# EAGLE board XMICRO-VDP V1.0 (EAGLE 6.3)
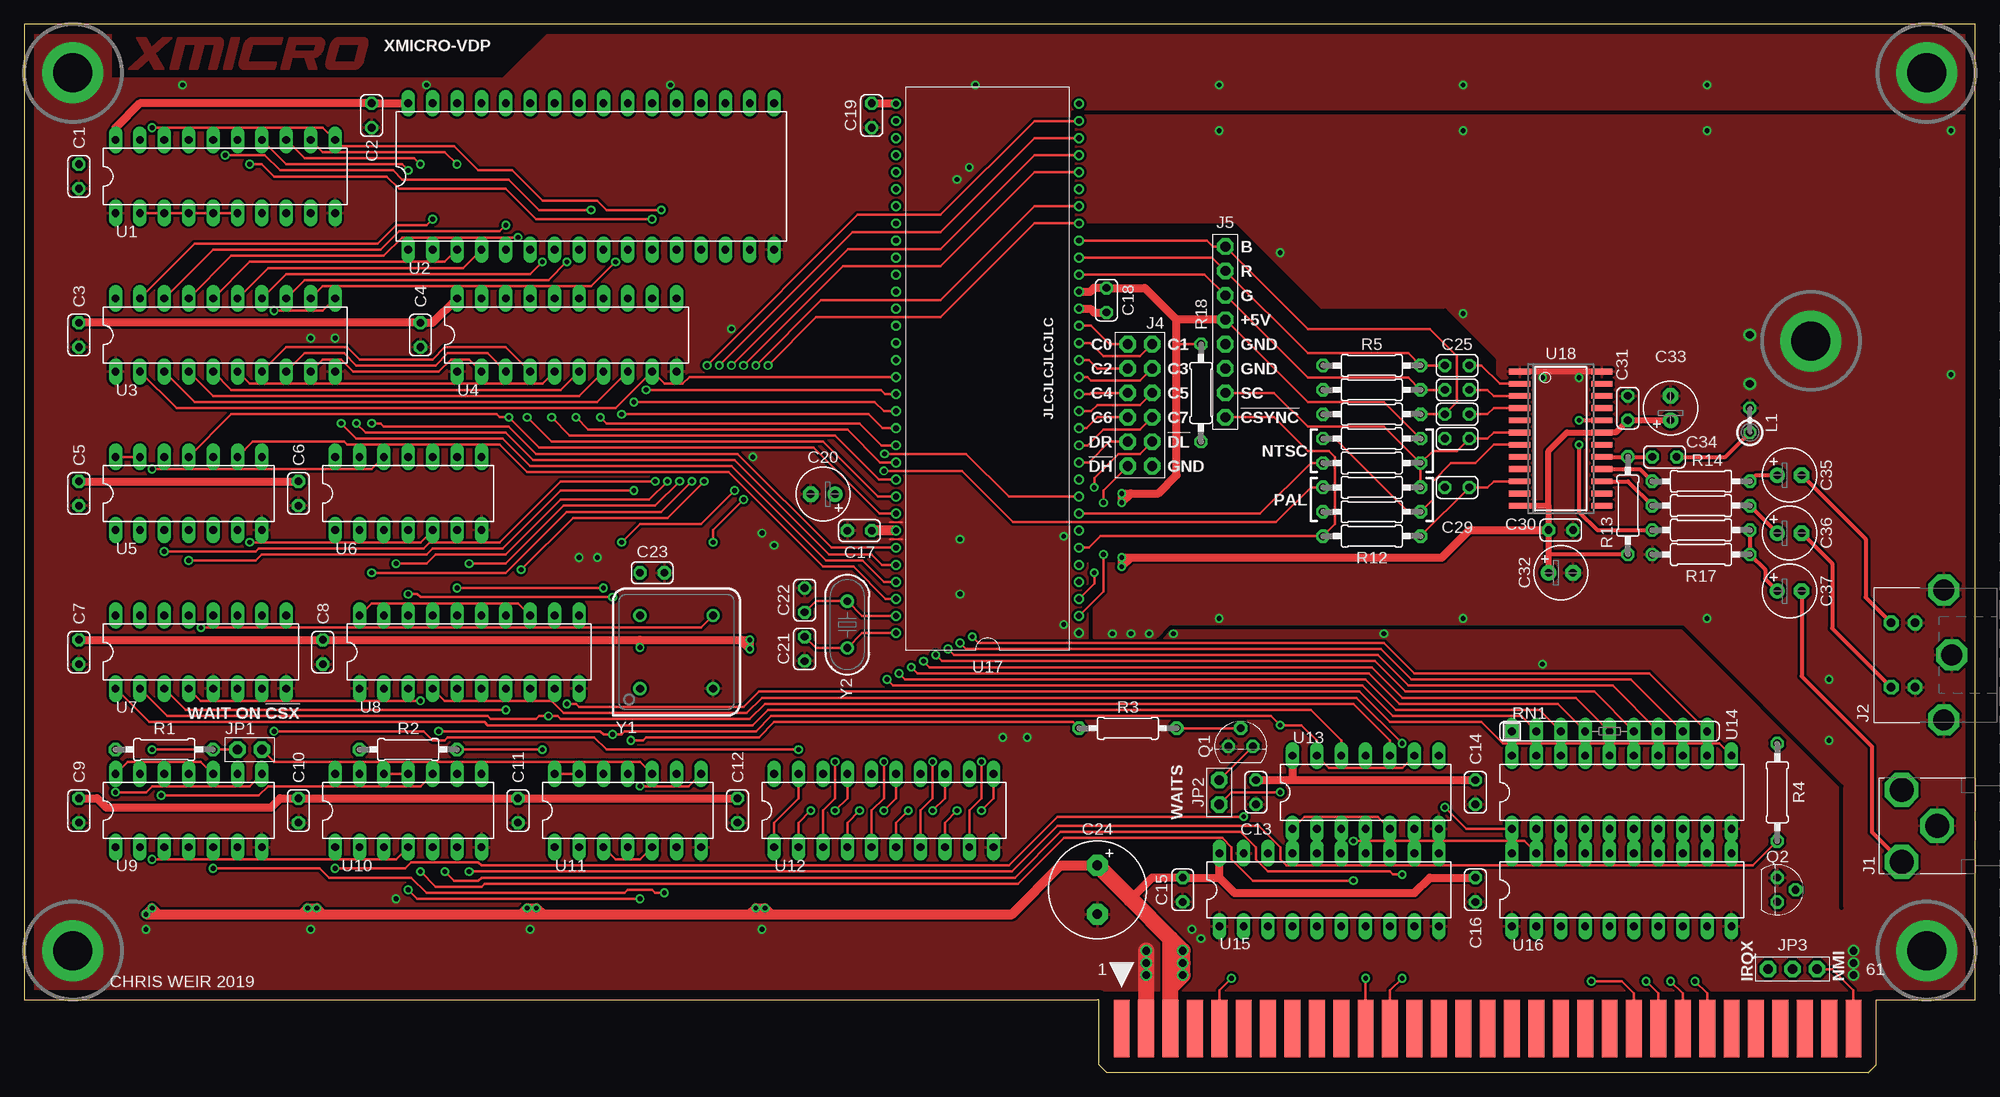
[diagram p5: board, top side]
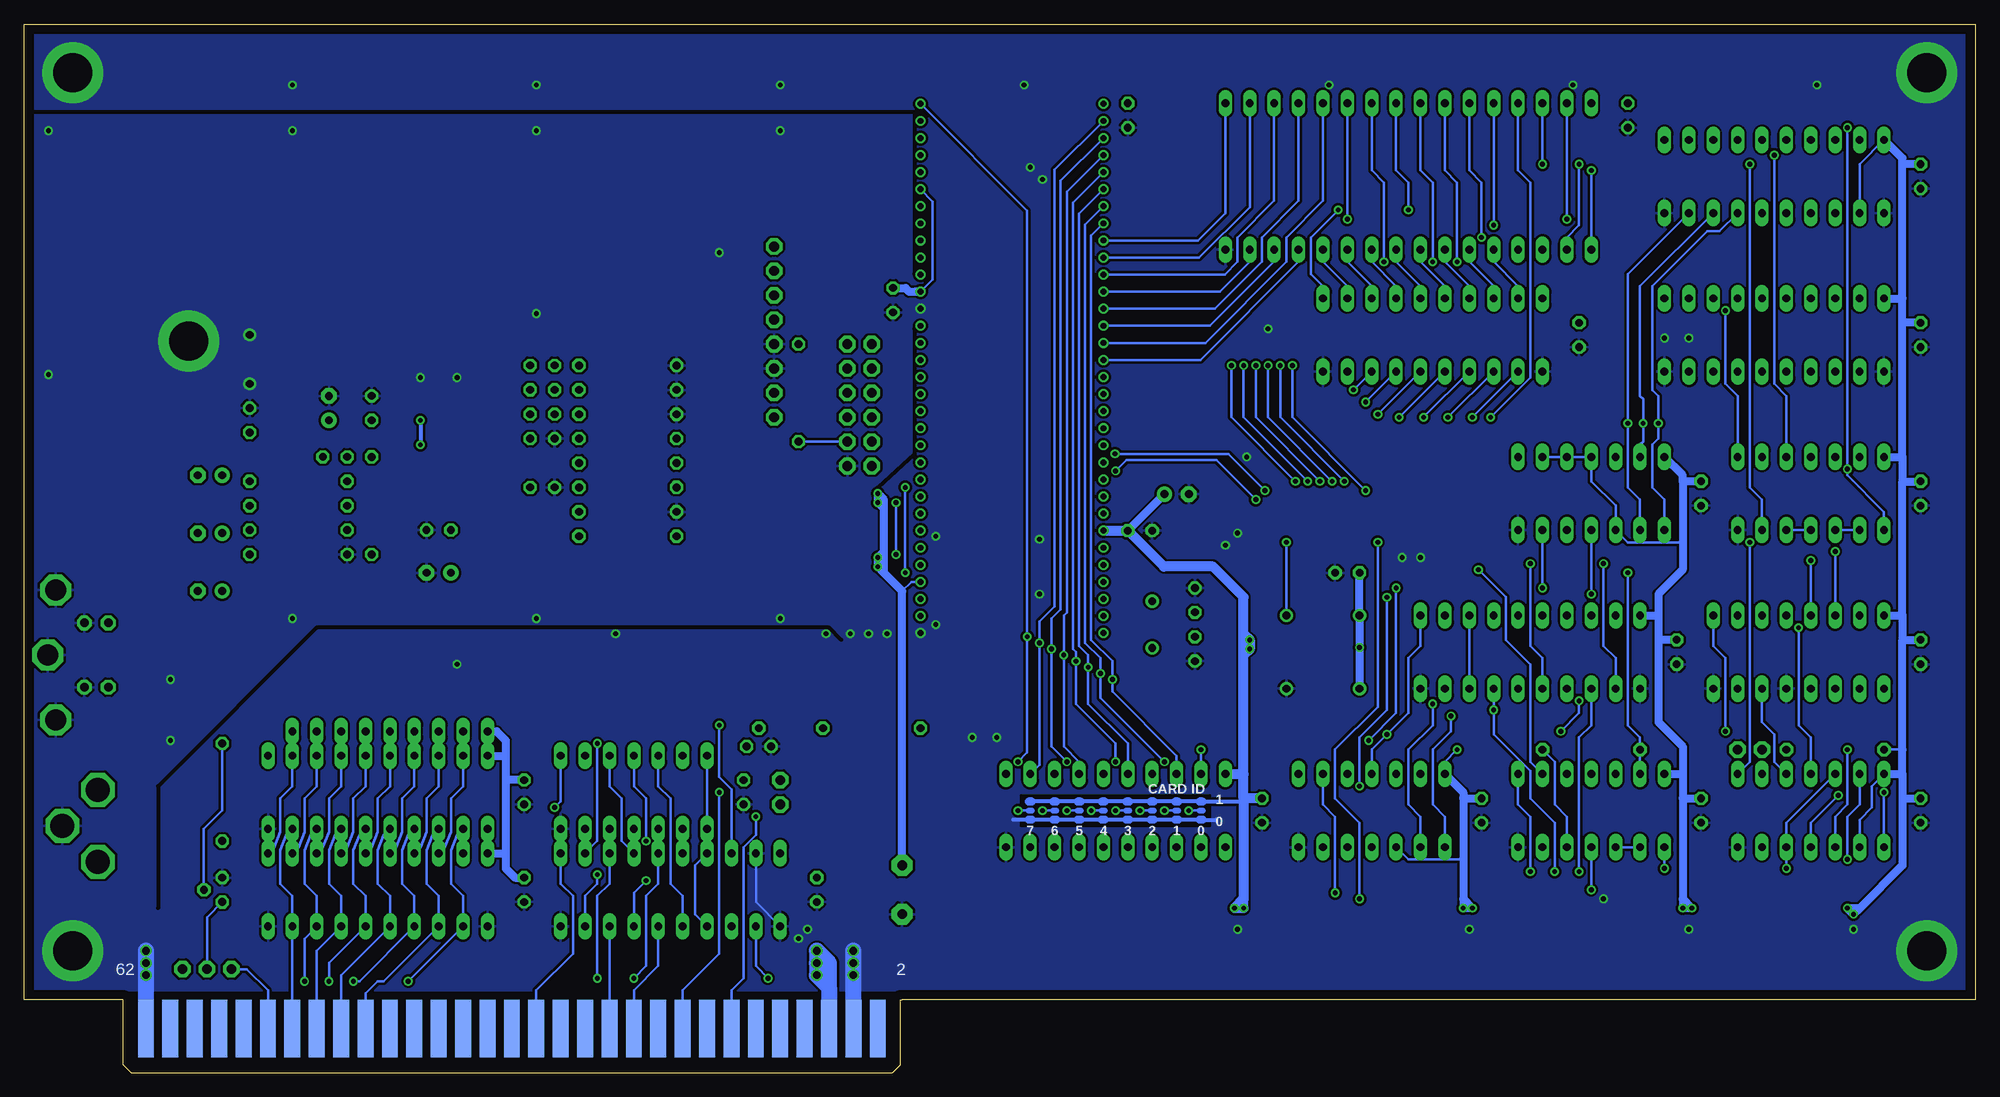
[diagram p6: board, bottom side, seen from below]

Size 203.2 x 109.22 mm. Coordinates in mm from the lower left corner, seen from the top.
Outline: 111.76,7.62 0,7.62 0,109.22 203.2,109.22 203.2,7.62 193.04,7.62
Copper layers (1*16): Top 0.035mm / dielectric 1.5mm / Bottom 0.035mm
Design rules "default *": minimum track width 6mil, minimum drill 0.3mm, track to track 10mil, track to pad 9mil, pad to pad 10mil, via to via 10mil, smd to smd 10mil, copper to edge 40mil, drill to drill 10mil, minimum pad ring 8mil, minimum via ring 8mil, stop-mask expansion 3mil, vias tented up to drill 30mil, thermal gap 10mil
Net classes: 0 default: width 0.254 mm; 1 GND: width 0.254 mm, clearance 0.254 mm to class 0; 2 SUPPLY: width 0.254 mm, clearance 0.254 mm to class 0, clearance 0.381 mm to class 1; 3 LOGO: width 0.152 mm
tRestrict: area 109.2,53.3 to 153,88.3; 7 lines
bRestrict: area 79.7,25.7 to 99.4,28.9; 8 lines

## Footprints (pad centres in the part's own frame; a part is rotated, then mirrored left to right if it is on the bottom)
C100 = drill 0.8 octagon: P$1 -1.27,0; P$2 1.27,0
E2,5-6 = drill 0.813 pad 1.6: + -1.27,0 | drill 0.813 pad 1.6 octagon: - 1.27,0
C-10-5 = drill 1.016 pad 2.184 octagon: + -2.54,0; - 2.54,0
EDGE62M = smd 1.651 x 5.969: 1 -38.1,-3.01; 3 -35.56,-3.01; 5 -33.02,-3.01; 7 -30.48,-3.01; 9 -27.94,-3.01; 11 -25.4,-3.01; 13 -22.86,-3.01; 15 -20.32,-3.01; 17 -17.78,-3.01; 19 -15.24,-3.01; 21 -12.7,-3.01; 23 -10.16,-3.01; 25 -7.62,-3.01; 27 -5.08,-3.01; 29 -2.54,-3.01; 31 0,-3.01; 33 2.54,-3.01; 35 5.08,-3.01; 37 7.62,-3.01; 39 10.16,-3.01; 41 12.7,-3.01; 43 15.24,-3.01; 45 17.78,-3.01; 47 20.32,-3.01; 49 22.86,-3.01; 51 25.4,-3.01; 53 27.94,-3.01; 55 30.48,-3.01; 57 33.02,-3.01; 59 35.56,-3.01; 61 38.1,-3.01 | smd 1.651 x 5.969 bottom: 2 -38.1,-3.01; 4 -35.56,-3.01; 6 -33.02,-3.01; 8 -30.48,-3.01; 10 -27.94,-3.01; 12 -25.4,-3.01; 14 -22.86,-3.01; 16 -20.32,-3.01; 18 -17.78,-3.01; 20 -15.24,-3.01; 22 -12.7,-3.01; 24 -10.16,-3.01; 26 -7.62,-3.01; 28 -5.08,-3.01; 30 -2.54,-3.01; 32 0,-3.01; 34 2.54,-3.01; 36 5.08,-3.01; 38 7.62,-3.01; 40 10.16,-3.01; 42 12.7,-3.01; 44 15.24,-3.01; 46 17.78,-3.01; 48 20.32,-3.01; 50 22.86,-3.01; 52 25.4,-3.01; 54 27.94,-3.01; 56 30.48,-3.01; 58 33.02,-3.01; 60 35.56,-3.01; 62 38.1,-3.01
PJRAN1 = drill 2.5 octagon: SHUNT 3.75,7.7; SLEEVE 0,4; TIP -3.75,7.7
MINI-DIN4 = drill 0.9 octagon: 1 -3.35,-8.51; 2 3.35,-8.51; 3 -3.35,-11; 4 3.35,-11 | drill 2.2 octagon: G$1 6.76,-5.51; G$2 -6.76,-5.51; G$3 0,-4.7
2X06 = drill 1.016 octagon: 1 -6.35,-1.27; 2 -6.35,1.27; 3 -3.81,-1.27; 4 -3.81,1.27; 5 -1.27,-1.27; 6 -1.27,1.27; 7 1.27,-1.27; 8 1.27,1.27; 9 3.81,-1.27; 10 3.81,1.27; 11 6.35,-1.27; 12 6.35,1.27
1X08 = drill 1.016 octagon: 1 -8.89,0; 2 -6.35,0; 3 -3.81,0; 4 -1.27,0; 5 1.27,0; 6 3.81,0; 7 6.35,0; 8 8.89,0
1X02 = drill 1.016 octagon: 1 -1.27,0; 2 1.27,0
1X03 = drill 1.016 octagon: 1 -2.54,0; 2 0,0; 3 2.54,0
0204V = drill 0.813 octagon: 1 -1.27,0; 2 1.27,0
TO92 = drill 0.813 octagon: 1 -1.27,0; 2 0,1.905; 3 1.27,0
0207/10 = drill 0.813 octagon: 1 -5.08,0; 2 5.08,0
SIL9 = drill 0.813 long: 1 -10.16,0; 2 -7.62,0; 3 -5.08,0; 4 -2.54,0; 5 0,0; 6 2.54,0; 7 5.08,0; 8 7.62,0; 9 10.16,0
DIL20 = drill 0.813 long: 1 -11.43,-3.81; 2 -8.89,-3.81; 3 -6.35,-3.81; 4 -3.81,-3.81; 5 -1.27,-3.81; 6 1.27,-3.81; 7 3.81,-3.81; 8 6.35,-3.81; 9 8.89,-3.81; 10 11.43,-3.81; 11 11.43,3.81; 12 8.89,3.81; 13 6.35,3.81; 14 3.81,3.81; 15 1.27,3.81; 16 -1.27,3.81; 17 -3.81,3.81; 18 -6.35,3.81; 19 -8.89,3.81; 20 -11.43,3.81
DIL32-6 = drill 0.813 long: 1 -19.05,-7.62; 2 -16.51,-7.62; 3 -13.97,-7.62; 4 -11.43,-7.62; 5 -8.89,-7.62; 6 -6.35,-7.62; 7 -3.81,-7.62; 8 -1.27,-7.62; 9 1.27,-7.62; 10 3.81,-7.62; 11 6.35,-7.62; 12 8.89,-7.62; 13 11.43,-7.62; 14 13.97,-7.62; 15 16.51,-7.62; 16 19.05,-7.62; 17 19.05,7.62; 18 16.51,7.62; 19 13.97,7.62; 20 11.43,7.62; 21 8.89,7.62; 22 6.35,7.62; 23 3.81,7.62; 24 1.27,7.62; 25 -1.27,7.62; 26 -3.81,7.62; 27 -6.35,7.62; 28 -8.89,7.62; 29 -11.43,7.62; 30 -13.97,7.62; 31 -16.51,7.62; 32 -19.05,7.62
DIL14 = drill 0.813 long: 1 -7.62,-3.81; 2 -5.08,-3.81; 3 -2.54,-3.81; 4 0,-3.81; 5 2.54,-3.81; 6 5.08,-3.81; 7 7.62,-3.81; 8 7.62,3.81; 9 5.08,3.81; 10 2.54,3.81; 11 0,3.81; 12 -2.54,3.81; 13 -5.08,3.81; 14 -7.62,3.81
DIL16 = drill 0.813 long: 1 -8.89,-3.81; 2 -6.35,-3.81; 3 -3.81,-3.81; 4 -1.27,-3.81; 5 1.27,-3.81; 6 3.81,-3.81; 7 6.35,-3.81; 8 8.89,-3.81; 9 8.89,3.81; 10 6.35,3.81; 11 3.81,3.81; 12 1.27,3.81; 13 -1.27,3.81; 14 -3.81,3.81; 15 -6.35,3.81; 16 -8.89,3.81
SDIP64 = drill 0.61 pad 1.016: 1 -27.559,-9.525; 2 -25.781,-9.525; 3 -24.003,-9.525; 4 -22.225,-9.525; 5 -20.447,-9.525; 6 -18.669,-9.525; 7 -16.891,-9.525; 8 -15.113,-9.525; 9 -13.335,-9.525; 10 -11.557,-9.525; 11 -9.779,-9.525; 12 -8.001,-9.525; 13 -6.223,-9.525; 14 -4.445,-9.525; 15 -2.667,-9.525; 16 -0.889,-9.525; 17 0.889,-9.525; 18 2.667,-9.525; 19 4.445,-9.525; 20 6.223,-9.525; 21 8.001,-9.525; 22 9.779,-9.525; 23 11.557,-9.525; 24 13.335,-9.525; 25 15.113,-9.525; 26 16.891,-9.525; 27 18.669,-9.525; 28 20.447,-9.525; 29 22.225,-9.525; 30 24.003,-9.525; 31 25.781,-9.525; 32 27.559,-9.525; 33 27.559,9.525; 34 25.781,9.525; 35 24.003,9.525; 36 22.225,9.525; 37 20.447,9.525; 38 18.669,9.525; 39 16.891,9.525; 40 15.113,9.525; 41 13.335,9.525; 42 11.557,9.525; 43 9.779,9.525; 44 8.001,9.525; 45 6.223,9.525; 46 4.445,9.525; 47 2.667,9.525; 48 0.889,9.525; 49 -0.889,9.525; 50 -2.667,9.525; 51 -4.445,9.525; 52 -6.223,9.525; 53 -8.001,9.525; 54 -9.779,9.525; 55 -11.557,9.525; 56 -13.335,9.525; 57 -15.113,9.525; 58 -16.891,9.525; 59 -18.669,9.525; 60 -20.447,9.525; 61 -22.225,9.525; 62 -24.003,9.525; 63 -25.781,9.525; 64 -27.559,9.525
SOP-24 = smd 0.6 x 2.2: 1 -6.985,-4.282; 2 -5.715,-4.282; 3 -4.445,-4.282; 4 -3.175,-4.282; 5 -1.905,-4.282; 6 -0.635,-4.282; 7 0.635,-4.282; 8 1.905,-4.282; 9 3.175,-4.282; 10 4.445,-4.282; 11 5.715,-4.282; 12 6.985,-4.282; 13 6.985,4.282; 14 5.715,4.282; 15 4.445,4.282; 16 3.175,4.282; 17 1.905,4.282; 18 0.635,4.282; 19 -0.635,4.282; 20 -1.905,4.282; 21 -3.175,4.282; 22 -4.445,4.282; 23 -5.715,4.282; 24 -6.985,4.282
DIL08S = drill 0.813: 1 -3.81,-3.81; 4 3.81,-3.81; 5 3.81,3.81; 8 -3.81,3.81
HC-49US = drill 0.813: 1 -2.44,0; 2 2.44,0

## Placement (x,y rotation side)
C1  0.1uF  [C100]  5.71,93.34 270 top
C2  0.1uF  [C100]  36.2,99.7 270 top
C3  0.1uF  [C100]  5.71,76.84 270 top
C4  0.1uF  [C100]  41.27,76.84 270 top
C5  0.1uF  [C100]  5.71,60.32 270 top
C6  0.1uF  [C100]  28.57,60.32 270 top
C7  0.1uF  [C100]  5.71,43.81 270 top
C8  0.1uF  [C100]  31.11,43.81 270 top
C9  0.1uF  [C100]  5.71,27.3 270 top
C10  0.1uF  [C100]  28.57,27.3 270 top
C11  0.1uF  [C100]  51.44,27.3 270 top
C12  0.1uF  [C100]  74.3,27.3 270 top
C13  0.1uF  [C100]  128.27,29.21 270 top
C14  0.1uF  [C100]  151.13,29.21 270 top
C15  0.1uF  [C100]  120.65,19.05 270 top
C16  0.1uF  [C100]  151.13,19.05 270 top
C17  0.1uF  [C100]  87,56.45 180 top
C18  0.1uF  [C100]  112.71,80.45 270 top
C19  0.1uF  [C100]  88.27,99.7 270 top
C20  47uF  [E2,5-6]  83.19,60.26 180 top
C21  22pF  [C100]  81.28,44.13 270 top
C22  22pF  [C100]  81.28,49.21 90 top
C23  0.1uF  [C100]  65.41,52.07 0 top
C24  220uF  [C-10-5]  111.76,19.05 270 top
C25  0.1uF  [C100]  149.22,73.66 0 top
C26  0.1uF  [C100]  149.22,71.12 0 top
C27  0.1uF  [C100]  149.22,68.58 0 top
C28  5pF  [C100]  149.22,66.04 180 top
C29  47pF  [C100]  149.22,60.96 180 top
C30  10nF  [C100]  160.02,56.52 0 top
C31  10nF  [C100]  167,69.22 90 top
C32  47uF  [E2,5-6]  160.02,52.07 0 top
C33  47uF  [E2,5-6]  171.45,69.22 90 top
C34  28pF  [C100]  170.81,64.14 0 top
C35  220uF  [E2,5-6]  183.83,62.23 0 top
C36  220uF  [E2,5-6]  183.83,56.2 0 top
C37  220uF  [E2,5-6]  183.83,50.16 0 top
CE1  XMICRO-BUS-EDGE62M  [EDGE62M]  152.4,7.62 0 top
J1  PJRAN1XU04AUX  [PJRAN1]  203.2,25.72 90 top
J2  MINI-DIN4  [MINI-DIN4]  205.42,43.5 270 top
J4  PINHD-2X6  [2X06]  116.2,69.53 270 top
J5  PINHD-1X8  [1X08]  125.09,77.15 270 top
JP1  PINHD-1X2THRU  [1X02]  23.5,33.66 180 top
JP2  PINHD-1X2THRU  [1X02]  124.46,29.21 270 top
JP3  PINHD1X3THRU  [1X03]  184.15,10.79 0 top
L1  68uH  [0204V]  179.71,67.95 90 top
Q1  VN2106  [TO92]  126.68,33.97 0 top
Q2  VN2106  [TO92]  182.56,19.05 270 top
R1  10k  [0207/10]  14.61,33.66 180 top
R2  3.3k  [0207/10]  40.01,33.66 0 top
R3  0  [0207/10]  114.94,35.88 0 top
R4  0  [0207/10]  182.56,29.21 90 top
R5  470  [0207/10]  140.34,73.66 0 top
R6  470  [0207/10]  140.34,71.12 0 top
R7  470  [0207/10]  140.34,68.58 0 top
R8  0  [0207/10]  140.34,66.04 0 top
R9  2.2k  [0207/10]  140.34,63.5 0 top
R10  2.2k  [0207/10]  140.34,60.96 0 top
R11  0  [0207/10]  140.34,58.42 180 top
R12  2.2k  [0207/10]  140.34,55.88 0 top
R13  3.32k/1%  [0207/10]  167,59.05 90 top
R14  75  [0207/10]  174.62,61.59 0 top
R15  75  [0207/10]  174.62,59.05 0 top
R16  43  [0207/10]  174.62,56.52 0 top
R17  240  [0207/10]  174.62,53.97 0 top
R18  3.3k  [0207/10]  122.56,70.8 90 top
RN1  10k  [SIL9]  165.1,35.56 0 top
U1  74574  [DIL20]  20.95,93.34 0 top
U2  AS6C4008  [DIL32-6]  59.05,93.34 0 top
U3  74574  [DIL20]  20.95,76.84 0 top
U4  74574  [DIL20]  56.52,76.84 0 top
U5  7404  [DIL14]  17.14,60.32 0 top
U6  7410  [DIL14]  40.01,60.32 0 top
U7  74138  [DIL16]  18.41,43.81 0 top
U8  74373  [DIL20]  46.35,43.81 0 top
U9  7474  [DIL14]  17.14,27.3 0 top
U10  7414  [DIL14]  40.01,27.3 0 top
U11  7404  [DIL14]  62.87,27.3 0 top
U12  74244  [DIL20]  89.53,27.3 0 top
U13  7432  [DIL14]  139.7,29.21 0 top
U14  74574  [DIL20]  166.37,29.21 0 top
U15  74244  [DIL20]  135.89,19.05 0 top
U16  74245  [DIL20]  166.37,19.05 0 top
U17  V9958  [SDIP64]  100.33,73.34 90 top
U18  CXA2075  [SOP-24]  160.02,66.04 270 top
Y1  5MHz  [DIL08S]  67.94,43.81 0 top
Y2  21.47727MHz  [HC-49US]  85.72,46.67 90 top

## Tracks (layer width: path | path; a pad name or v marks a point on that pad's centre or on a via)
!BCSX  (via drill 0.5)
  Top 0.254: CE1.9 124.46,8.57 v125.73,9.84
  Bottom 0.254: v125.73,9.84 127,11.11 U15.2
!BRD  (via drill 0.5)
  Top 0.254: CE1.21 v139.7,9.84
  Bottom 0.254: v139.7,9.84 138.43,11.11 138.43,18.41 137.16,19.68 U15.15
!BRST  (via drill 0.5)
  Top 0.254: v127,26.67 107.63,26.67 102.55,21.59 47.62,21.59 47.31,21.91 40.32,21.91 39.69,21.27 v32.38,21.27
  Bottom 0.254: CE1.14 129.54,8.57 128.27,9.84 128.27,23.5 127,24.77 v127,26.67 | v32.38,21.27 U10.1
!BWAIT  (via drill 0.5)
  Top 0.254: v130.81,29.21 125.73,29.21 JP2.2
  Bottom 0.254: CE1.18 134.62,8.57 130.81,12.38 v130.81,29.21
!BWR
  Bottom 0.254: CE1.22 139.7,8.57 137.16,11.11 U15.6
!CSIDR  (via drill 0.5)
  Top 0.254: U12.1 78.11,26.04 80.64,28.57 U12.19 | v26.04,35.56 41.59,35.56 42.55,34.61 43.81,34.61 44.13,34.92 59.37,34.92 60.64,33.66 v80.64,33.66
  Bottom 0.254: U7.9 27.3,44.45 26.04,43.18 v26.04,35.56 | v80.64,33.66 U12.19
!CSVR  (via drill 0.5)
  Top 0.254: v63.5,60.64 55.88,60.64 49.85,54.61 42.55,54.61 41.91,53.97 24.77,53.97 24.13,53.34 v17.14,53.34 | v71.12,73.66 86.81,89.34 95.44,89.34 105.22,99.12 U17.31
  Bottom 0.254: v63.5,60.64 71.12,68.26 v71.12,73.66 | v17.14,53.34 U7.13
!CSVW  (via drill 0.5)
  Top 0.254: v72.39,73.66 86.3,87.57 95.44,87.57 105.22,97.34 U17.30 | v65.72,61.59 55.88,61.59 49.53,55.24 42.23,55.24 41.59,54.61 24.45,54.61 24.13,54.29 v14.61,54.29
  Bottom 0.254: v72.39,73.66 72.39,68.26 v65.72,61.59 | v14.61,54.29 U7.14
!CSX  (via drill 0.5)
  Top 0.254: U13.9 143.51,31.75 135.89,31.75 U13.13 134.62,34.61 133.03,36.2 v130.81,36.2 129.86,37.15 77.79,37.15 76.2,35.56 62.55,35.56 62.23,35.24 v61.28,35.24 60.33,35.24 60.01,35.56 v43.18,35.56 | U7.4 18.41,38.73 v41.27,38.73
  Bottom 0.254: U15.18 129.54,29.53 130.81,30.8 v130.81,36.2 | U11.11 62.87,33.66 v61.28,35.24 59.05,37.46 59.05,43.18 57.78,44.45 U8.11 | v41.27,38.73 41.27,37.46 v43.18,35.56
!CSYNC
  Top 0.254: U17.6 110.87,54.67 112.08,55.88 R12.1 136.53,57.15 136.53,64.14 135.89,64.77 133.67,64.77 130.18,68.26 J5.8
!DHCLK  (via drill 0.5)
  Top 0.254: U17.2 112.39,50.1 v112.39,53.97 | v112.39,59.37 112.39,60.64 J4.11
  Bottom 0.254: v112.39,53.97 v112.39,59.37
!DLCLK  (via drill 0.5)
  Top 0.254: U17.3 111.44,50.93 v111.44,52.07 | v111.44,60.96 111.44,61.91 113.98,64.45 116.2,64.45 J4.10
  Bottom 0.254: v111.44,52.07 v111.44,60.96 | J4.10 R18.1
!RD
  Top 0.254: U13.12 137.16,34.61 133.99,37.78 77.47,37.78 75.88,36.2 48.26,36.2 47.94,36.51 13.02,36.51 U7.1
  Bottom 0.254: U15.5 134.62,18.41 135.89,19.68 135.89,28.57 137.16,29.85 U13.12
!RST  (via drill 0.5)
  Top 0.254: U17.9 102.55,60.01 98.11,64.45 v89.6,64.45 | v73.98,60.64 70.48,57.15 64.14,57.15 v62.23,55.24 | v13.34,22.23 38.73,22.23 U10.4 | v64.14,18.1 40.96,18.1 v40.01,19.05
  Bottom 0.254: v89.6,64.45 77.79,64.45 v73.98,60.64 | U9.13 12.06,27.94 13.34,26.67 v13.34,22.23 | v62.23,55.24 62.23,38.1 66.67,33.66 66.67,28.57 64.14,26.04 v64.14,18.1 | v40.01,19.05 U10.4
!VCAS0  (via drill 0.5)
  Top 0.254: v33.02,67.63 34.61,66.04 49.85,66.04 52.7,63.18 73.66,63.18 83.5,53.34 87.31,53.34 89.53,51.12 U17.61
  Bottom 0.254: U1.7 26.67,87.63 27.94,87.63 33.66,81.92 33.66,71.12 33.02,70.48 v33.02,67.63 33.02,66.04 33.66,65.41 33.66,60.96 32.38,59.69 U6.1
!VCAS1  (via drill 0.5)
  Top 0.254: U17.60 89.34,52.9 88.27,53.97 83.82,53.97 73.98,63.82 53.02,63.82 50.16,66.67 35.56,66.67 v34.61,67.63
  Bottom 0.254: U1.8 34.92,81.92 34.92,70.48 34.61,70.17 v34.61,67.63 34.61,65.72 34.92,65.41 U6.13
!VCAS2  (via drill 0.5)
  Top 0.254: v36.2,67.63 37.15,67.63 37.47,67.31 50.48,67.31 53.34,64.45 74.3,64.45 84.07,54.67 U17.59
  Bottom 0.254: U1.9 36.2,83.19 v36.2,67.63 36.2,60.96 34.92,59.69 U6.2
!VINT  (via drill 0.5)
  Top 0.254: U17.25 105.22,88.45 95.44,78.68 82.49,78.68 v77.47,73.66 | v70.8,61.59 66.99,57.78 57.15,57.78 v51.75,52.39
  Bottom 0.254: v77.47,73.66 77.47,68.26 v70.8,61.59 | v51.75,52.39 48.9,49.53 48.9,45.09 46.35,42.54 46.35,32.38 U10.9
!VRAS
  Top 0.254: U5.9 23.81,65.72 33.34,65.72 33.66,65.41 49.53,65.41 52.39,62.55 73.34,62.55 83.19,52.7 86.36,52.7 89.72,49.34 U17.62
!VWAIT  (via drill 0.5)
  Top 0.254: U17.26 105.22,90.23 95.44,80.45 83,80.45 v76.2,73.66 | v69.53,61.59 66.36,58.42 56.52,58.42 50.16,52.07 v36.2,52.07
  Bottom 0.254: U10.13 R2.1 34.92,34.92 36.2,36.2 v36.2,52.07 | v76.2,73.66 76.2,68.26 v69.53,61.59
!WR  (via drill 0.5)
  Top 0.254: U13.10 142.24,34.61 138.43,38.42 77.15,38.42 75.56,36.83 55.88,36.83 55.56,37.15 v54.61,37.15 53.66,37.15 53.34,36.83 48.58,36.83 48.26,37.15 14.92,37.15 U7.2
  Bottom 0.254: U15.14 140.97,24.13 140.97,28.57 142.24,29.85 U13.10 | U11.1 55.24,26.67 56.52,27.94 56.52,33.66 54.61,35.56 v54.61,37.15
A0  (via drill 0.5)
  Top 0.254: v138.43,20 127.95,20 125.73,22.23 125.73,23.5 124.78,24.45 108.27,24.45 103.5,19.68 47.94,19.68 47.62,19.37 42.86,19.37 v41.27,20.96
  Bottom 0.254: U15.7 139.7,18.73 v138.43,20 | v41.27,20.96 41.27,34.92 40.01,36.2 U8.3
A1  (via drill 0.5)
  Top 0.254: v143.51,34.29 138.75,39.05 76.83,39.05 75.25,37.46 56.2,37.46 54.93,38.73 43.81,38.73 U8.4
  Bottom 0.254: U15.12 143.51,24.13 v143.51,34.29
A7  (via drill 0.5)
  Top 0.254: v143.51,20.64 142.56,20.64 142.24,20.96 129.54,20.96 128.27,22.23 128.27,23.5 126.68,25.08 107.95,25.08 103.19,20.32 47.62,20.32 47.31,20 44.77,20 v43.81,20.96 | U7.3 16.83,37.78 v50.16,37.78
  Bottom 0.254: U15.9 144.78,18.41 143.51,19.68 v143.51,20.64 | v43.81,20.96 43.81,26.04 46.35,28.57 46.35,31.43 50.16,35.24 v50.16,37.78 U8.7
B
  Top 0.254: R7.2 C27.P$1 149.22,69.85 149.22,74.61 146.37,77.47 133.67,77.47 J5.1 123.83,86.04 123.19,86.68 U17.24
BA0  (via drill 0.5)
  Top 0.254: CE1.23 142.24,8.57 v143.51,9.84
  Bottom 0.254: v143.51,9.84 143.51,18.41 142.24,19.68 U15.13
BA1
  Bottom 0.254: CE1.24 U15.8
BA7
  Bottom 0.254: CE1.30 149.86,8.57 146.05,12.38 146.05,18.41 147.32,19.68 U15.11
C0
  Top 0.254: U17.19 111.12,77.79 113.03,75.88 J4.1
C1
  Top 0.254: U17.18 111,76.01 112.39,74.61 116.2,74.61 J4.2
C2
  Top 0.254: U17.17 110.87,74.23 111.76,73.34 J4.3
C3
  Top 0.254: U17.16 110.74,72.45 111.12,72.07 116.2,72.07 J4.4
C4
  Top 0.254: U17.15 111,70.68 111.12,70.8 J4.5
C5
  Top 0.254: U17.14 111.12,68.9 111.76,69.53 116.2,69.53 J4.6
C6
  Top 0.254: U17.13 110.62,67.12 111.76,68.26 J4.7
C7
  Top 0.254: U17.12 110.74,65.34 112.39,66.99 116.2,66.99 J4.8
CBDR
  Top 0.254: U17.11 110.87,63.56 113.03,65.72 J4.9
D0  (via drill 0.5)
  Top 0.254: RN1.2 155.89,37.15 142.56,37.15 139.38,40.32 90.49,40.32 v89.85,40.96
  Bottom 0.254: U16.18 159.38,23.5 158.75,25.08 158.75,28.57 157.48,29.85 U14.19 RN1.2 | U17.40 92.08,87.19 92.08,45.09 89.85,42.86 v89.85,40.96 89.85,39.69 83.19,33.02 U12.18
D1  (via drill 0.5)
  Top 0.254: RN1.3 157.8,37.78 142.88,37.78 139.7,40.96 91.76,40.96 v91.12,41.59 | U12.3 83.19,27.3 84.45,28.57 v84.45,32.38
  Bottom 0.254: U16.17 161.93,23.5 161.29,25.08 161.29,28.57 160.02,29.85 U14.18 RN1.3 | U17.39 92.71,88.33 92.71,44.77 91.12,43.18 v91.12,41.59 91.12,39.05 v84.45,32.38
D2  (via drill 0.5)
  Top 0.254: RN1.4 159.7,38.42 143.19,38.42 140.02,41.59 93.03,41.59 v92.39,42.23
  Bottom 0.254: U16.16 164.47,23.5 163.83,25.08 163.83,28.57 162.56,29.85 U14.17 RN1.4 | U17.38 93.34,89.47 93.34,44.45 92.39,43.5 v92.39,42.23 92.39,38.42 88.27,34.29 U12.16
D3  (via drill 0.5)
  Top 0.254: RN1.5 161.61,39.05 143.51,39.05 140.34,42.23 94.3,42.23 v93.66,42.86 | U12.5 88.27,27.3 89.53,28.57 v89.53,32.38
  Bottom 0.254: U16.15 167,23.5 166.37,25.08 166.37,28.57 165.1,29.85 U14.16 RN1.5 | U17.37 93.98,90.62 93.98,44.13 93.66,43.81 v93.66,42.86 93.66,38.42 89.53,34.29 v89.53,32.38
D4  (via drill 0.5)
  Top 0.254: RN1.6 163.51,39.69 143.83,39.69 140.65,42.86 95.57,42.86 v94.93,43.5
  Bottom 0.254: U16.14 169.54,23.5 168.91,25.08 168.91,28.57 167.64,29.85 U14.15 RN1.6 | U17.36 94.61,91.76 94.61,47.94 94.93,47.62 v94.93,43.5 94.93,33.97 93.34,32.38 U12.14
D5  (via drill 0.5)
  Top 0.254: RN1.7 165.42,40.32 144.15,40.32 140.97,43.5 96.84,43.5 v96.2,44.13 | U12.7 93.34,27.3 94.61,28.57 v94.61,32.38
  Bottom 0.254: U16.13 172.09,23.5 171.45,25.08 171.45,28.57 170.18,29.85 U14.14 RN1.7 | U17.35 95.25,92.9 95.25,48.26 96.2,47.31 v96.2,44.13 96.2,33.97 v94.61,32.38
D6  (via drill 0.5)
  Top 0.254: RN1.8 167.32,40.96 144.46,40.96 141.29,44.13 98.11,44.13 v97.47,44.77
  Bottom 0.254: U16.12 174.62,23.5 173.99,25.08 173.99,28.57 172.72,29.85 U14.13 RN1.8 | U17.34 95.89,94.04 95.89,48.58 97.47,46.99 v97.47,44.77 97.47,32.07 U12.12
D7  (via drill 0.5)
  Top 0.254: RN1.9 169.23,41.59 144.78,41.59 141.6,44.77 99.38,44.77 v98.74,45.4 | U12.9 98.42,27.3 99.69,28.57 v99.69,32.38
  Bottom 0.254: U16.11 177.16,23.5 176.53,25.08 176.53,28.57 175.26,29.85 U14.12 RN1.9 | U17.32 98.74,89.79 v98.74,45.4 98.74,33.34 v99.69,32.38
G
  Top 0.254: C26.P$1 R6.2 144.15,72.39 133.67,72.39 J5.3 122.94,83.12 U17.22
GND  (via drill 0.5, 0.8, 0.8 pad 1.32, 4.06 pad 6.35)
  Top 0.229: 90.17,55.56 91.44,55.56 | 90.17,57.34 91.44,57.34
  Top 0.61: U18.24 U18.1
  Top 0.813: U17.20 111.03,79.56 111.41,79.18 C18.P$2
  Top 1.651: v116.84,12.7 v116.84,11.43 v116.84,10.16 CE1.4
  Bottom 0.254: U15.19 127,17.78 U15.1
  Bottom 0.406: 98.58,26.35 100.17,26.35 | 96.04,26.35 98.27,26.35 | 93.5,26.35 95.73,26.35 | 90.96,26.35 93.19,26.35 | 88.42,26.35 90.65,26.35 | 85.88,26.35 88.11,26.35 | 83.34,26.35 85.57,26.35 | 80.8,26.35 83.03,26.35 | 80.49,26.35 79.06,26.35
  Bottom 0.813: 98.27,26.35 98.58,26.35 | 95.73,26.35 96.04,26.35 | 93.19,26.35 93.5,26.35 | 90.65,26.35 90.96,26.35 | 88.11,26.35 88.42,26.35 | 85.57,26.35 85.88,26.35 | 83.03,26.35 83.34,26.35 | 80.49,26.35 80.8,26.35
  Bottom 1.651: CE1.4 v116.84,10.16 v116.84,11.43 v116.84,12.7 | CE1.62 v190.5,10.16 v190.5,11.43 v190.5,12.7
  other vias: 5.08,12.7 5.08,104.14 158.12,72.39 161.93,72.39 198.12,12.7 198.12,104.14 32.38,76.52 179.71,71.76 179.71,76.84 121.6,14.92 122.56,13.97 57.78,53.66 59.69,53.66 78.11,54.93 75.88,64.14 76.83,56.2 119.7,45.72 141.6,45.72 158.12,42.54 108.27,46.67 104.46,34.92 101.92,34.92 97.47,49.85 97.47,55.56 38.73,18.1 52.7,14.92 76.83,14.92 29.84,14.92 12.7,14.92 29.84,76.52 97.16,93.03 98.42,94.3 113.35,45.72 117.16,45.72 115.25,45.72 186.06,76.2 108.27,55.88 200.66,98.11 175.26,98.11 149.86,98.11 124.46,98.11 149.86,79.06 130.81,85.41 200.66,72.71 124.46,47.31 149.86,47.31 175.26,47.31 187.96,34.61 187.96,40.96 175.26,102.87 149.86,102.87 124.46,102.87 99.06,102.87 67.31,102.87 41.91,102.87 16.51,102.87 73.66,77.47
  pour Bottom (rank 3): 0,109.22 203.2,109.22 203.2,7.62 192.72,7.62 192.72,8.57 112.08,8.57 112.08,7.62 0,7.62
  pour Top (rank 3): 0,109.22 9.02,109.22 9.02,103.51 49.85,103.51 55.56,109.22 203.2,109.22 203.2,7.62 192.72,7.62 192.72,8.57 112.08,8.57 112.08,7.62 0,7.62
  pour Top (isolate 0.254): 92.08,58.04 92.08,54.86 89.53,54.86 89.53,58.04
  pour Top (isolate 0.254, no thermals): 110.81,46.74 110.81,44.64 108.9,44.64 108.9,46.74
  pour Bottom (isolate 0.254, no thermals): 110.81,46.74 110.81,44.64 108.9,44.64 108.9,46.74
  pour Bottom (isolate 0.254, no thermals): 110.81,80.39 110.81,78.61 108.9,78.61 108.9,80.39
ID0  (via drill 0.5)
  Top 0.254: U12.2 80.64,26.04 v81.92,27.3
  Bottom 0.254: v81.92,27.3 80.8,27.3
  Bottom 0.61: 80.8,27.3 80.49,27.3
ID1  (via drill 0.5)
  Top 0.254: U12.17 85.72,28.57 v84.45,27.3
  Bottom 0.254: v84.45,27.3 83.34,27.3
  Bottom 0.61: 83.34,27.3 83.03,27.3
ID2  (via drill 0.5)
  Top 0.254: U12.4 85.72,26.04 v87,27.3
  Bottom 0.254: v87,27.3 85.88,27.3
  Bottom 0.61: 85.88,27.3 85.57,27.3
ID3  (via drill 0.5)
  Top 0.254: U12.15 90.81,28.57 v89.53,27.3
  Bottom 0.254: v89.53,27.3 88.42,27.3
  Bottom 0.61: 88.42,27.3 88.11,27.3
ID4  (via drill 0.5)
  Top 0.254: U12.6 90.81,26.04 v92.08,27.3
  Bottom 0.254: v92.08,27.3 90.96,27.3
  Bottom 0.61: 90.96,27.3 90.65,27.3
ID5  (via drill 0.5)
  Top 0.254: U12.13 95.89,28.57 v94.61,27.3
  Bottom 0.254: v94.61,27.3 93.5,27.3
  Bottom 0.61: 93.5,27.3 93.19,27.3
ID6  (via drill 0.5)
  Top 0.254: U12.8 95.89,26.04 v97.16,27.3
  Bottom 0.254: v97.16,27.3 96.04,27.3
  Bottom 0.61: 96.04,27.3 95.73,27.3
ID7  (via drill 0.5)
  Top 0.254: U12.11 100.97,28.57 v99.69,27.3
  Bottom 0.254: v99.69,27.3 98.58,27.3
  Bottom 0.61: 98.58,27.3 98.27,27.3
LOGO
  pour Top: 26.95,107.79 26.78,107.1 23.79,107.1 23.31,105.22 26.28,105.22 26.12,104.53 22.83,104.53 arc-47 22.56,104.64 arc-36 22.42,104.96 arc-17 22.43,105.22 arc-5 22.46,105.37 22.86,106.95 arc-33 23.23,107.55 arc-31 23.61,107.78 arc-13 23.75,107.79
  pour Top: 10.87,104.53 11.86,104.53 12.97,105.56 13.53,104.53 14.58,104.53 13.63,106.16 15.41,107.79 14.43,107.79 13.3,106.75 12.74,107.79 11.7,107.79 12.64,106.13
  pour Top: 21.56,107.79 22.44,107.79 21.6,104.53 20.72,104.53
  pour Top: 27.6,107.79 28.3,107.1 28.12,106.39 30.23,106.39 30.41,107.1 28.32,107.1 27.62,107.79 30.75,107.79 arc-55 31.17,107.58 arc-31 31.28,107.32 arc-18 31.25,107 31.14,106.58 arc-18 31.06,106.4 arc-18 30.75,106 arc-19 30.44,105.8 arc-14 30.09,105.74 30.52,104.53 29.65,104.53 29.21,105.75 27.94,105.75 27.62,104.53 26.75,104.53
  pour Top: 15.17,104.53 16.01,107.79 20.29,107.79 arc-50 20.62,107.66 arc-37 20.75,107.37 arc-17 20.72,106.99 20.08,104.53 19.21,104.53 19.88,107.1 18.74,107.1 18.07,104.53 17.19,104.53 17.86,107.1 16.72,107.1 16.05,104.53
  pour Top: 32.83,107.1 34.92,107.1 34.42,105.22 32.3,105.22 32.8,107.1 32.85,107.79 32.75,107.79 arc33 32.36,107.65 arc19 32.07,107.33 arc18 31.89,106.95 31.47,105.35 arc9 31.45,105.25 arc9 31.44,105.01 arc22 31.48,104.8 arc36 31.61,104.62 arc17 31.73,104.55 arc13 31.87,104.53 34.45,104.53 arc18 34.66,104.55 arc16 34.84,104.65 arc14 35.08,104.87 arc26 35.33,105.34 35.77,107.01 arc17 35.79,107.29 arc19 35.75,107.51 arc66 35.37,107.79 32.88,107.79
N$3
  Top 0.254: U18.2 153.67,71.76 151.76,73.66 C25.P$2
N$4
  Top 0.254: U18.3 153.03,70.48 152.4,71.12 C26.P$2
N$5
  Top 0.254: U18.4 153.03,69.22 152.4,68.58 C27.P$2
N$9
  Bottom 0.254: R4.2 182.56,27.3 184.47,25.4 Q2.2
N$10
  Bottom 0.254: Q2.3 184.15,16.19 JP3.2
N$11  (via drill 0.5)
  Top 0.254: v46.35,20.96 102.87,20.96 107.63,25.72 128.59,25.72 130.81,23.5 130.81,22.23 131.44,21.59 180.02,21.59 R4.1
  Bottom 0.254: v46.35,20.96 46.35,26.67 47.62,27.94 U10.8
N$12
  Top 0.406: U18.15 167,61.59 R15.1
N$13
  Top 0.406: U18.16 168.28,62.86 R14.1
N$14  (via drill 0.5)
  Top 0.406: U18.20 v161.93,67.95 | v161.93,65.41 161.93,58.42 163.83,56.52 R16.1
  Bottom 0.406: v161.93,67.95 v161.93,65.41
N$15
  Top 0.406: R16.2 R17.2 181.29,52.39 181.29,51.43 C37.+
N$16
  Top 0.406: R14.2 180.34,62.23 C35.+
N$17
  Top 0.406: R15.2 C36.+
N$18
  Top 0.254: JP2.1 Q1.3
N$19  (via drill 0.5)
  Top 0.254: U10.10 41.27,29.85 25.4,29.85 24.45,28.89 v14.29,28.89
  Bottom 0.254: v14.29,28.89 17.14,26.04 U9.4
N$20
  Top 0.254: U10.12 U10.11
N$21
  Top 0.406: C34.P$2 177.16,64.14 L1.1
N$22
  Top 0.254: U18.10 153.03,61.59 152.4,60.96 C29.P$1 R12.2
N$26
  Top 0.254: U18.7 153.03,65.41 151.13,63.5 148.59,63.5 146.69,61.59 146.69,59.69 R11.1 144.15,58.42 136.53,66.04 R8.1
N$27
  Bottom 0.254: U10.3 U10.2
N$28
  Top 0.254: U17.63 87.28,47.56 Y2.2 82.45,49.11 C22.P$1
N$29
  Top 0.406: C36.- 188.28,53.02 188.28,46.29 J2.4
N$30
  Top 0.254: U17.64 87.28,45.78 Y2.1 82.45,44.23 C21.P$1
N$31  (via drill 0.5)
  Top 0.254: v26.04,79.38 31.11,79.38 U3.11
  Bottom 0.254: U5.8 24.77,70.48 26.04,71.76 v26.04,79.38
N$32
  Bottom 0.254: U4.12 65.41,81.92 67.94,84.45 U2.12
N$33
  Bottom 0.254: U14.9 175.9,24.77 176.53,23.18 176.53,19.68 175.26,18.41 U16.9 CE1.50
N$34  (via drill 0.5)
  Top 0.254: v173.99,9.53 175.26,8.26 CE1.49
  Bottom 0.254: U14.8 173.35,24.77 173.99,23.18 173.99,19.68 172.72,18.41 U16.8 173.99,13.97 v173.99,9.53
N$35
  Bottom 0.254: U14.7 170.81,24.77 171.45,23.18 171.45,19.68 170.18,18.41 U16.7 172.72,12.7 CE1.48
N$36  (via drill 0.5)
  Top 0.254: CE1.47 172.72,8.26 v171.45,9.53
  Bottom 0.254: U14.6 168.28,24.77 168.91,23.18 168.91,19.68 167.64,18.41 U16.6 171.45,11.43 v171.45,9.53
N$37
  Bottom 0.254: U14.5 165.74,24.77 166.37,23.18 166.37,19.68 165.1,18.41 U16.5 170.18,10.16 CE1.46
N$38  (via drill 0.5)
  Top 0.254: CE1.45 170.18,8.26 v168.91,9.53
  Bottom 0.254: U14.4 163.19,24.77 163.83,23.18 163.83,19.68 162.56,18.41 U16.4 168.28,9.53 v168.91,9.53
N$39
  Bottom 0.254: U14.3 160.66,24.77 161.29,23.18 161.29,19.68 160.02,18.41 U16.3 165.74,9.53 166.37,9.53 167.64,8.26 CE1.44
N$40  (via drill 0.5)
  Top 0.254: CE1.43 167.64,8.26 166.37,9.53 v163.19,9.53
  Bottom 0.254: U14.2 158.12,24.77 158.75,23.18 158.75,19.68 157.48,18.41 U16.2 v163.19,9.53
N$41
  Bottom 0.254: U4.13 62.87,81.92 65.41,84.45 U2.11
N$42
  Bottom 0.254: U2.10 62.87,84.45 60.33,81.92 U4.14
N$43
  Bottom 0.254: U2.9 60.33,84.45 57.78,81.92 U4.15
N$44
  Bottom 0.254: U2.8 57.78,84.45 55.24,81.92 U4.16
N$45
  Bottom 0.254: U2.7 55.24,84.45 52.7,81.92 U4.17
N$46
  Bottom 0.254: U2.6 52.7,84.45 50.16,81.92 U4.18
N$47
  Bottom 0.254: U2.5 50.16,84.45 47.62,81.92 U4.19
N$48  (via drill 0.5)
  Top 0.254: v66.36,89.85 60.64,89.85 59.69,90.81 53.98,90.81 50.8,93.98 47.31,93.98 44.77,96.52 33.02,96.52 U1.11 31.11,98.43 v13.34,98.43 | U6.12 36.2,62.86 v13.34,62.86
  Bottom 0.254: v66.36,89.85 69.22,87 69.22,83.19 67.94,81.92 U4.11 | U5.1 9.53,58.42 13.34,62.23 v13.34,62.86 v13.34,98.43
N$49  (via drill 0.5)
  Top 0.254: v20.95,95.57 25.08,95.57 26.67,93.98 38.42,93.98 39.37,93.03 50.48,93.03 53.66,89.85 v59.05,89.85
  Bottom 0.254: U5.10 19.68,70.48 20.95,71.76 v20.95,95.57 | v59.05,89.85 59.05,92.71 60.33,93.98 U2.24
N$50  (via drill 0.5)
  Top 0.254: v23.5,94.62 24.77,94.62 26.04,93.34 37.78,93.34 39.05,92.08 50.16,92.08 53.34,88.9 v65.41,88.9
  Bottom 0.254: U5.6 22.23,59.69 23.5,60.96 v23.5,94.62 | v65.41,88.9 U2.22
N$51
  Top 0.254: R3.2 Q1.2
N$52
  Top 0.254: U11.10 64.14,32.38 26.04,32.38 JP1.1
N$53
  Top 0.406: C37.- 185.1,41.27 192.41,33.97 192.41,25.06 J1.TIP
N$54  (via drill 0.5)
  Top 0.254: U16.19 156.21,24.13 v138.43,24.13
  Bottom 0.254: v138.43,24.13 138.43,28.57 139.7,29.85 U13.11
N$55  (via drill 0.5)
  Top 0.254: U14.11 176.53,34.29 153.99,34.29 151.76,36.51 142.24,36.51 139.06,39.69 76.52,39.69 74.93,38.1 57.78,38.1 57.47,38.42 v56.52,38.42
  Bottom 0.254: U11.2 57.78,26.67 59.05,27.94 59.05,33.66 56.52,36.2 v56.52,38.42
N$56  (via drill 0.5)
  Top 0.254: U14.1 150.18,25.4 v147.96,27.62
  Bottom 0.254: v147.96,27.62 147.32,28.26 U13.8
N$57  (via drill 0.5)
  Top 0.254: U3.12 31.11,81.92 59.05,81.92 v61.59,84.45
  Bottom 0.254: v61.59,84.45 61.59,92.71 62.87,93.98 U2.23
N$58  (via drill 0.5)
  Top 0.254: U3.13 29.21,82.55 54.61,82.55 v56.52,84.45
  Bottom 0.254: v56.52,84.45 56.52,92.71 57.78,93.98 U2.25
N$59  (via drill 0.5)
  Top 0.254: U3.14 27.3,83.19 52.7,83.19 v53.98,84.45
  Bottom 0.254: v53.98,84.45 53.98,92.71 55.24,93.98 U2.26
N$60
  Top 0.254: U3.15 25.4,83.82 45.72,83.82 U2.4
N$61
  Top 0.254: U3.16 23.5,84.45 43.81,84.45 U2.3
N$62  (via drill 0.5)
  Top 0.254: U3.17 21.59,85.09 37.47,85.09 39.37,87 v51.44,87
  Bottom 0.254: v51.44,87 51.44,92.71 52.7,93.98 U2.27
N$63  (via drill 0.5)
  Top 0.254: U3.18 19.68,85.73 37.15,85.73 39.05,87.63 49.53,87.63 v50.16,88.27
  Bottom 0.254: v50.16,88.27 U2.28
N$64  (via drill 0.5)
  Top 0.254: U3.19 17.78,86.36 36.83,86.36 38.73,88.27 41.91,88.27 v42.55,88.9
  Bottom 0.254: v42.55,88.9 U2.31
N$65  (via drill 0.5)
  Top 0.254: U1.13 29.21,95.25 40.64,95.25 v41.27,94.62
  Bottom 0.254: v41.27,94.62 41.27,88.27 42.55,87 U2.2
N$66  (via drill 0.5)
  Top 0.254: U1.12 31.11,95.89 43.81,95.89 v45.09,94.62
  Bottom 0.254: v45.09,94.62 U2.30
N$67  (via drill 0.5)
  Top 0.254: U1.14 27.3,94.62 39.37,94.62 v40.01,93.98
  Bottom 0.254: v40.01,93.98 U2.1
N$69  (via drill 0.5)
  Top 0.254: U17.29 105.22,95.57 95.44,85.79 85.79,85.79 v73.66,73.66 | v66.99,61.59 65.09,59.69 55.88,59.69 50.16,53.97 42.86,53.97 41.91,53.02 v38.73,53.02
  Bottom 0.254: v73.66,73.66 73.66,68.26 v66.99,61.59 | v38.73,53.02 38.73,44.45 37.47,43.18 U8.2
N$70
  Top 0.813: U17.33 88.33,100.9 C19.P$1
N$71
  Top 0.406: U18.17 R13.2 C34.P$1
N$72
  Top 0.254: CE1.61 190.5,8.57 188.28,10.79 JP3.3
N$73  (via drill 0.5)
  Top 0.254: v45.09,50.48 v60.33,50.48 | v63.18,34.61 64.45,34.61 64.77,34.92 76.52,34.92 78.11,36.51 109.22,36.51 R3.1
  Bottom 0.254: U6.6 v45.09,50.48 | v60.33,50.48 60.33,37.46 v63.18,34.61
N$74
  Bottom 0.254: CE1.52 177.8,8.57 180.02,10.79 JP3.1
N$75  (via drill 0.5)
  Top 0.254: U17.28 105.22,93.79 95.44,84.01 85.28,84.01 v74.93,73.66 | v68.26,61.59 65.72,59.05 56.2,59.05 50.16,53.02 v46.35,53.02
  Bottom 0.254: v74.93,73.66 74.93,68.26 v68.26,61.59 | v46.35,53.02 46.35,44.45 45.09,43.18 U8.5
N$76
  Bottom 0.254: U5.2 U5.3
N$77  (via drill 0.5)
  Top 0.254: v66.67,18.73 65.72,18.73 65.41,19.05 62.87,19.05 62.55,18.73 41.91,18.73 40.32,20.32 31.75,20.32 30.8,21.27 v19.68,21.27
  Bottom 0.254: U9.12 19.68,26.04 U9.5 v19.68,21.27 | U11.9 67.94,27.94 66.67,26.67 v66.67,18.73
N$78  (via drill 0.5)
  Top 0.254: v40.01,49.85 40.96,49.85 41.27,49.53 v61.28,49.53 | v64.14,29.85 69.22,29.85 U11.8
  Bottom 0.254: U6.4 v40.01,49.85 | v61.28,49.53 61.28,37.78 64.14,34.92 v64.14,29.85
N$79  (via drill 0.5)
  Top 0.254: v9.53,29.21 12.7,29.21 13.34,29.85 23.5,29.85 U9.8 | U6.5 41.27,55.24 v23.5,55.24
  Bottom 0.254: U9.1 v9.53,29.21 | v23.5,55.24 23.5,32.38 U9.8
N$80
  Bottom 0.254: U5.4 U5.5
N$81
  Top 0.406: C35.- 191.77,55.56 191.77,49.5 J2.3
N$83  (via drill 0.5)
  Top 0.254: v13.34,33.66 R1.1 JP1.2
  Bottom 0.254: v13.34,33.66 13.34,27.94 14.61,26.67 U9.3
NTSC_SC
  Top 0.254: U17.8 128.71,58.23 133.99,63.5 R9.1
PAL_SC  (via drill 0.5)
  Top 0.254: v18.41,46.35 70.48,46.35 Y1.5 | R10.1 133.99,60.96 130.37,57.34 103,57.34 97.66,62.67 v89.53,62.67 | v74.93,59.69 71.75,56.52 v71.75,55.24
  Bottom 0.254: U9.11 17.14,34.92 18.41,36.2 v18.41,46.35 | v74.93,59.69 79.06,63.82 88.39,63.82 v89.53,62.67 | Y1.5 v71.75,55.24
R
  Top 0.254: C25.P$1 R5.2 144.15,74.93 133.67,74.93 J5.2 123.7,84.9 U17.23
SC
  Top 0.254: U18.6 153.03,66.67 152.4,66.04 C28.P$1 149.22,64.77 146.69,64.77 R9.2 | R10.2 R9.2 | R9.2 141.6,67.31 133.67,67.31 130.18,70.8 J5.7
VA0
  Top 0.254: U3.2 15.88,69.22 61.59,69.22 U4.9 66.67,71.76 68.58,71.76 69.28,72.45 U17.49
VA1  (via drill 0.5)
  Top 0.254: U4.8 59.69,69.85 17.78,69.85 U3.3 | v64.77,71.12 89.22,71.12 89.66,70.68 U17.50
  Bottom 0.254: U4.8 v64.77,71.12
VA2  (via drill 0.5)
  Top 0.254: U4.7 57.78,70.48 19.68,70.48 U3.4 | v63.5,69.85 88.58,69.85 89.53,68.9 U17.51
  Bottom 0.254: U4.7 v63.5,69.85
VA3  (via drill 0.5)
  Top 0.254: U4.6 55.88,71.12 21.59,71.12 U3.5 | v62.23,68.58 87.95,68.58 89.41,67.12 U17.52
  Bottom 0.254: U4.6 v62.23,68.58
VA4  (via drill 0.5)
  Top 0.254: U4.5 53.98,71.76 23.5,71.76 U3.6 | v60.01,68.26 60.64,67.63 87,67.63 89.28,65.34 U17.53
  Bottom 0.254: U4.5 v60.01,68.26
VA5  (via drill 0.5)
  Top 0.254: U4.4 50.16,75.56 43.81,75.56 42.55,74.3 34.92,74.3 33.66,75.56 27.3,75.56 U3.7 | v57.47,68.26 58.74,66.99 85.72,66.99 89.15,63.56 U17.54
  Bottom 0.254: U4.4 v57.47,68.26
VA6  (via drill 0.5)
  Top 0.254: U4.3 48.26,74.93 44.13,74.93 42.86,73.66 34.61,73.66 33.34,74.93 29.21,74.93 U3.8 | v54.93,68.26 56.83,66.36 84.45,66.36 89.03,61.79 U17.55
  Bottom 0.254: U4.3 v54.93,68.26
VA7  (via drill 0.5)
  Top 0.254: U3.9 31.11,74.3 33.02,74.3 34.29,73.03 43.18,73.03 44.45,74.3 46.35,74.3 U4.2 | v52.39,68.26 54.93,65.72 83.19,65.72 88.9,60.01 U17.56
  Bottom 0.254: U4.2 v52.39,68.26
VCC  (via drill 0.5, 0.8)
  Top 0.254: U1.2 U1.3 U1.4 U1.5 U1.6 | U9.14 10.79,32.38 18.41,32.38 U9.10 | 134.62,26.67 133.35,26.67 U13.1 | 134.62,26.67 139.7,26.67 | 139.7,26.67 140.97,26.67 U13.5 | U13.4 139.7,26.67 | U13.2 134.62,26.67 | U8.13 51.44,48.89 50.16,48.89 | 50.16,48.89 42.55,48.89 | 42.55,48.89 40.01,48.89 | 40.01,48.89 36.2,48.89 U8.20 | U8.18 40.01,48.89 | U8.17 42.55,48.89 | U8.14 50.16,48.89 | U5.14 U5.13 | U11.13 U11.14 | U11.3 61.59,22.23 64.14,22.23 U11.5 | R2.2 v53.98,33.66 | R8.2 141.6,69.85 133.67,69.85 J5.4 | R18.2 120.02,75.88
  Top 0.406: R13.1 158.75,53.97
  Top 0.61: U18.12 158.75,59.05 | 158.75,59.05 C30.P$1 158.75,53.97 C32.+ | C33.+ C31.P$1 165.74,66.67 U18.19 160.66,66.67 158.75,64.77 158.75,59.05
  Top 0.813: 124.46,20.32 C15.P$1 117.47,20.32 115.25,18.1 | 124.46,20.32 U15.20 | C13.P$1 132.08,30.48 | 132.08,30.48 C14.P$1 | U13.14 132.08,30.48 | U2.32 C2.P$1 12.06,100.97 9.53,98.43 U1.20 | C3.P$1 C4.P$1 42.55,78.11 U4.20 | 124.46,20.32 126.05,18.73 144.78,18.73 146.37,20.32 C16.P$1 | C9.P$1 7.62,28.57 8.57,27.62 25.72,27.62 26.67,28.57 C10.P$1 C11.P$1 C12.P$1 | C7.P$1 C8.P$1 64.14,45.09 | 64.14,45.09 74.61,45.09 | 74.61,45.09 v75.56,45.09 v75.56,44.13 74.61,45.09 | C5.P$1 C6.P$1 | v64.14,44.29 64.14,45.09 | J5.4 120.02,78.42 | 120.02,78.42 116.71,81.73 C18.P$1 111.41,81.73 111.03,81.34 U17.21 | 115.25,53.66 v114.3,53.66 v114.3,52.7 115.25,53.66 | 115.25,53.66 147.64,53.66 150.5,56.52 C30.P$1 | 115.25,60.32 v114.3,60.32 v114.3,59.37 115.25,60.32 | 115.25,60.32 118.11,60.32 120.02,62.23 120.02,75.88 120.02,78.42
  Top 1.016: U17.58 C17.P$1 | 13.97,16.51 v12.7,16.51 v13.34,17.14 13.97,16.51 | 13.97,16.51 51.75,16.51 | 51.75,16.51 53.98,16.51 | 53.98,16.51 75.56,16.51 | 75.56,16.51 77.79,16.51 | 77.79,16.51 102.87,16.51 107.95,21.59 C24.+ | 51.75,16.51 v52.39,17.14 v53.34,17.14 53.98,16.51 | 75.56,16.51 v76.2,17.14 v77.15,17.14 77.79,16.51 | 28.89,16.51 v29.53,17.14 v30.48,17.14 31.11,16.51
  Top 1.651: CE1.6 119.38,8.89 | 119.38,8.89 v120.65,10.16 v120.65,11.43 v120.65,12.7 119.38,13.97 | 119.38,13.97 115.25,18.1 C24.+ | 119.38,8.89 119.38,13.97
  Bottom 0.254: U13.14 U13.1 U15.17 133.35,21.59 133.35,16.51 U15.4 | U1.2 12.06,94.62 U1.20 | 30.48,55.24 36.2,55.24 U6.3 37.47,59.05 40.01,61.59 U6.11 U6.10 U6.9 | U9.10 20.95,32.38 20.95,35.24 22.23,36.51 U7.6 | R1.2 7.62,33.66 | U8.8 U8.13 | U9.2 12.06,26.35 10.79,27.62 10.79,29.85 U9.14 | v53.98,33.66 55.24,32.38 U11.14 | U10.5 42.55,26.67 43.81,27.94 43.81,32.38 R2.2 | U11.3 59.05,22.23 53.34,22.23 | U17.27 108.58,90.74 108.58,82.61 U17.21 | U17.4 110.81,51.12 111.76,50.16
  Bottom 0.406: 80.8,28.26 83.03,28.26 | 80.49,28.26 76.2,28.26 | 83.34,28.26 85.57,28.26 | 85.88,28.26 88.11,28.26 | 88.42,28.26 90.65,28.26 | 90.96,28.26 93.19,28.26 | 93.5,28.26 95.73,28.26 | 96.04,28.26 98.27,28.26
  Bottom 0.813: U14.20 153.03,33.02 | 153.03,33.02 153.03,30.48 | 153.03,30.48 153.03,22.86 | 153.03,22.86 153.03,21.27 152.08,20.32 C16.P$1 | U16.20 153.03,22.86 | C14.P$1 153.03,30.48 | 153.03,33.02 153.03,34.61 153.99,35.56 RN1.1 | C6.P$1 30.48,61.59 | 30.48,61.59 30.48,62.23 U6.14 | U5.14 7.62,64.14 | 7.62,64.14 7.62,61.59 | 7.62,61.59 C5.P$1 | 7.62,64.14 7.62,78.11 | 7.62,78.11 7.62,80.65 | 7.62,80.65 7.62,94.62 | 7.62,94.62 7.62,95.25 U1.20 | C1.P$1 7.62,94.62 | C3.P$1 7.62,78.11 | U3.20 7.62,80.65 | U7.16 7.62,47.62 | 7.62,47.62 7.62,45.09 | 7.62,45.09 C7.P$1 | U9.14 7.62,31.12 | 7.62,31.12 7.62,28.57 | 7.62,28.57 C9.P$1 | 7.62,31.12 7.62,33.66 7.62,45.09 | 7.62,47.62 7.62,61.59 | 30.48,61.59 30.48,55.24 30.48,52.39 33.02,49.85 33.02,47.62 | 33.02,47.62 33.02,45.09 | 33.02,45.09 33.02,36.51 30.48,33.97 30.48,31.12 | 30.48,31.12 30.48,28.57 | 30.48,28.57 C10.P$1 | U10.14 30.48,31.12 | C8.P$1 33.02,45.09 | U8.20 33.02,47.62 | U11.14 53.34,29.21 53.34,28.57 | 53.34,28.57 C11.P$1 | 53.34,28.57 53.34,22.23 53.34,18.1 | 53.34,18.1 v53.34,17.14 v52.39,17.14 53.34,18.1 | 7.62,28.57 7.62,21.59 12.06,17.14 | 30.48,28.57 30.48,18.1 | 80.49,28.26 80.8,28.26 | C23.P$1 Y1.8 v64.14,44.29 Y1.1 | C17.P$1 C20.+ | 12.06,17.14 v12.7,16.51 v13.34,17.14 12.06,17.14 | 30.48,18.1 v30.48,17.14 v29.53,17.14 30.48,18.1 | 83.03,28.26 83.34,28.26 | 85.57,28.26 85.88,28.26 | 88.11,28.26 88.42,28.26 | 90.65,28.26 90.96,28.26 | 93.19,28.26 93.5,28.26 | 95.73,28.26 96.04,28.26 | 98.27,28.26 98.58,28.26 | C24.+ 111.76,50.16 113.67,52.07 | 113.67,52.07 113.67,54.29 | C18.P$1 111.41,81.73 111.03,81.34 U17.21 | 113.67,54.29 v114.3,53.66 v114.3,52.7 113.67,52.07 | 113.67,54.29 113.67,58.74 | 113.67,58.74 113.67,59.69 v114.3,60.32 v114.3,59.37 113.67,58.74
  Bottom 0.813: U17.21 110.49,81.34 | 109.79,81.28 U17.21
  Bottom 1.016: 76.2,28.57 76.2,31.12 | U12.20 76.2,31.12 | 76.2,31.12 76.2,43.5 | 76.2,43.5 76.2,45.72 | 76.2,45.72 76.2,49.53 79.38,52.7 84.52,52.7 C17.P$1 U17.58 | C12.P$1 76.2,28.57 | 76.2,28.57 76.2,28.26 76.2,18.1 | 76.2,18.1 v77.15,17.14 v76.2,17.14 76.2,18.1 | 76.2,45.72 v75.56,45.09 v75.56,44.13 76.2,43.5
  Bottom 1.651: 119.38,8.89 v120.65,10.16 v120.65,11.43 v120.65,12.7 119.38,11.43 119.38,8.89 | 119.38,8.89 CE1.6
VD0
  Bottom 0.254: U2.17 78.11,89.54 80.96,86.68 U17.41
VD1
  Bottom 0.254: U2.18 75.56,90.17 80.83,84.9 U17.42
VD2
  Bottom 0.254: U17.43 78.17,83.12 76.83,84.45 76.83,87 73.03,90.81 U2.19
VD3
  Bottom 0.254: U17.44 78.68,81.34 75.56,84.45 U2.15
VD4
  Bottom 0.254: U17.45 79.18,79.56 74.3,84.45 74.3,87 70.48,90.81 U2.20
VD5
  Bottom 0.254: U17.46 79.69,77.79 73.03,84.45 U2.14
VD6
  Bottom 0.254: U17.47 80.2,76.01 71.75,84.45 71.75,87 67.94,90.81 U2.21
VD7
  Bottom 0.254: U17.48 80.71,74.23 70.48,84.45 U2.13
VR/!W  (via drill 0.5)
  Top 0.254: U5.11 21.59,68.58 49.21,68.58 49.53,68.26 v50.48,68.26 53.66,65.09 82.23,65.09 89.09,58.23 U17.57
  Bottom 0.254: U2.29 47.62,93.98 46.35,92.71 46.35,72.39 v50.48,68.26

## Text on the board
tPlace: JLCJLCJLCJLC | CHRIS WEIR 2019
bPlace: CARD ID | 1 | 0 | 0 | 1 | 2 | 3 | 4 | 5 | 6 | 7
tNames: XMICRO-VDP | B | R | G | +5V | C0 | C1 | GND | C2 | C3 | GND | C4 | C5 | SC | C6 | C7 | !CSYNC | DR | !DL | NTSC | !DH | GND | PAL | WAIT ON !CSX! | WAITS | IRQX | NMI
tValues: V1 1946